# EAGLE design HMLPGVCA (EAGLE 9.6.2)
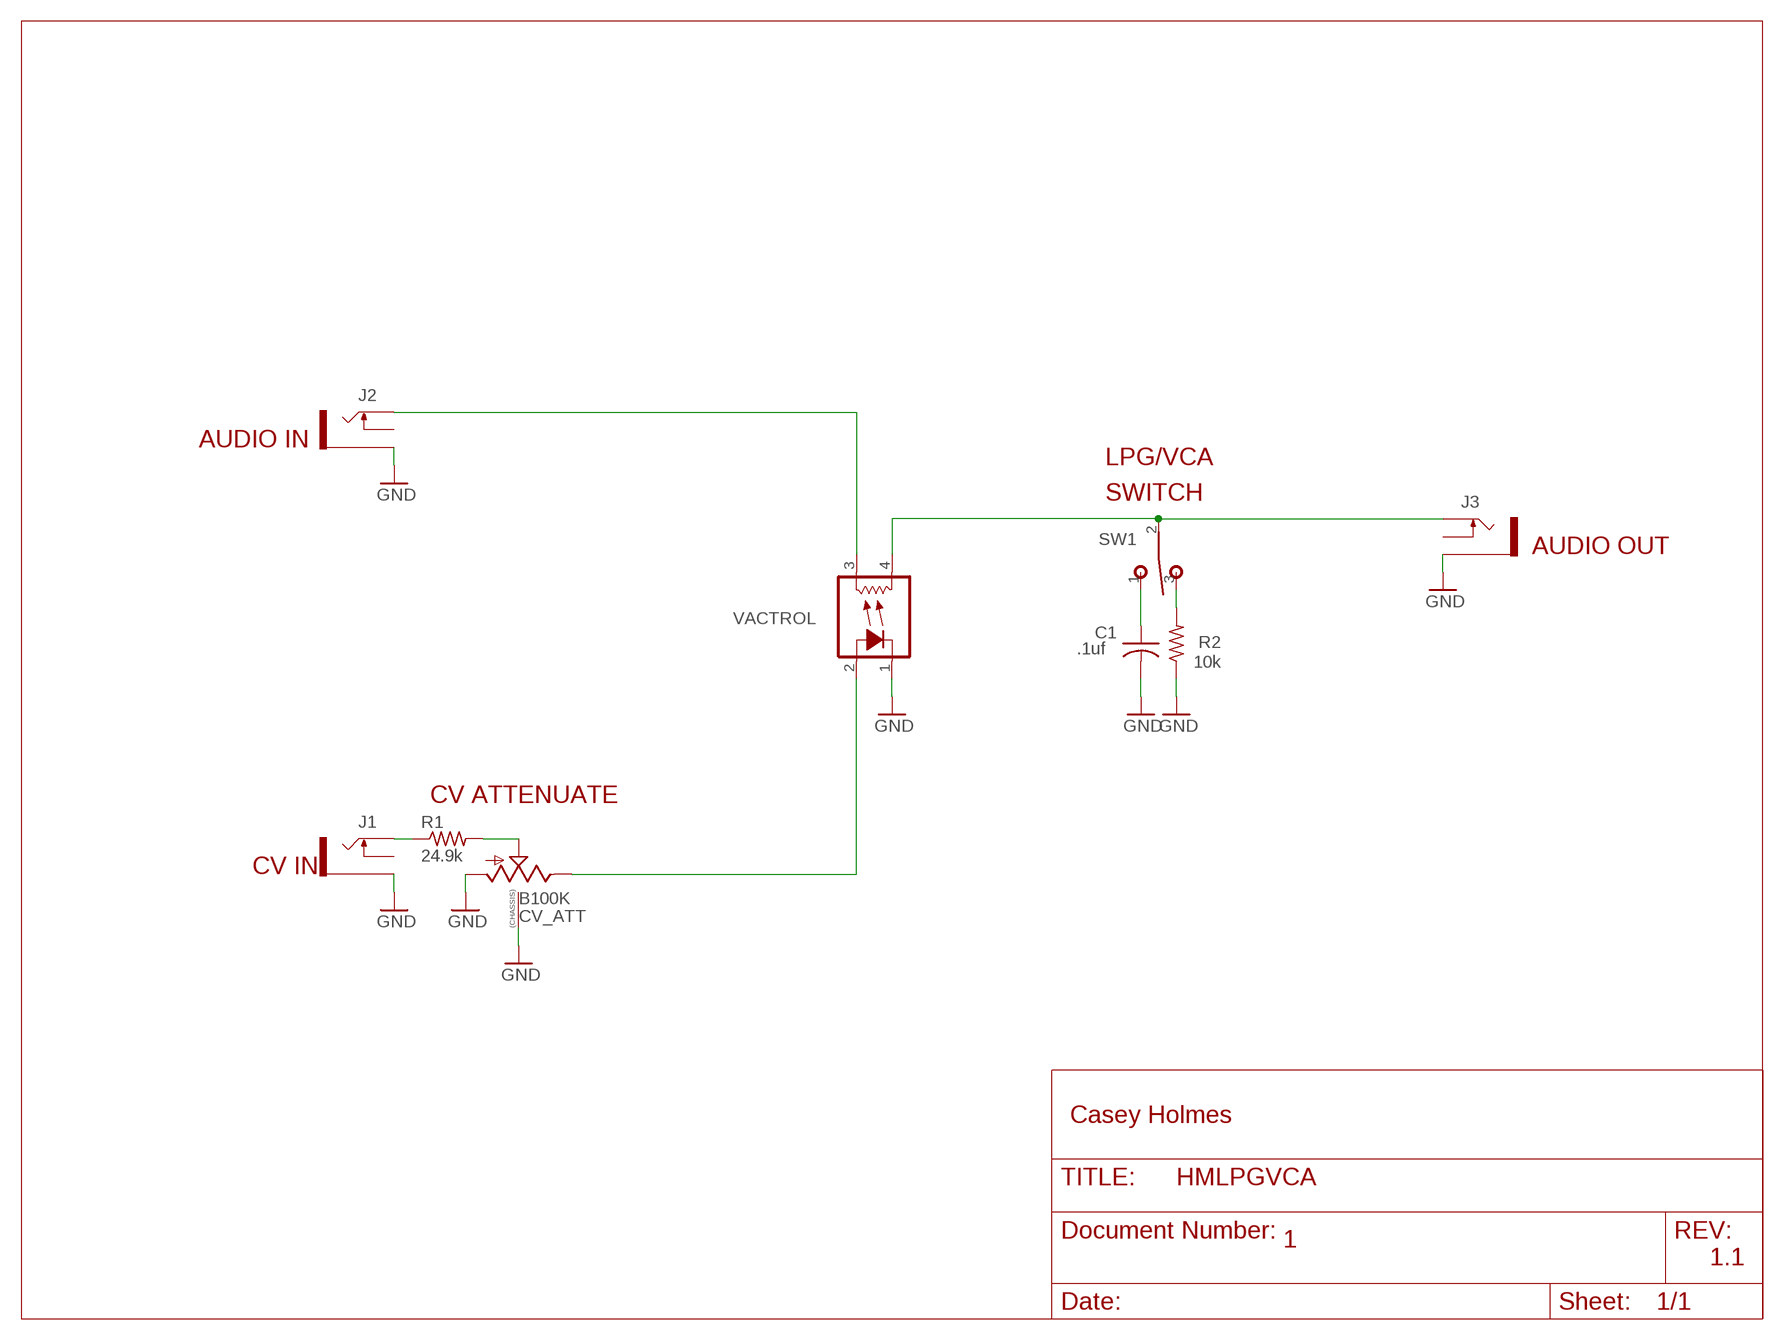
[diagram p0: schematic, sheet 1]

## Parts
C1  .1uf  C-USC0805K  [C0805K]
CV_ATT  B100K  9MM_SNAP-IN_POT_CHASSIS  [9MM_SNAP-IN_POT]
J1  THONKICONNNEW  [WQP-PJ301M-12_JACK]
J2  THONKICONNNEW  [WQP-PJ301M-12_JACK]
J3  THONKICONNNEW  [WQP-PJ301M-12_JACK]
R1  24.9k  R-US_R0805  [R0805]
R2  10k  R-US_R0805  [R0805]
SW1  T-80-T-SPDT-ON-OFF-ON  [M9040P]
VACTROL  VACTROL  VACTROL_4PIN  [VACTROL_4PIN_VTL5C]

## Nets
GND: C1.2 CV_ATT.1(A) CV_ATT.CHASSIS1 CV_ATT.CHASSIS2 J1.P$3_SLEEVE(SLEEVE) J2.P$3_SLEEVE(SLEEVE) J3.P$3_SLEEVE(SLEEVE) R2.1 VACTROL.1(LED-)
N$1: J1.P$1_TIP(TIP) R1.1
N$2: CV_ATT.2(S) R1.2
N$3: CV_ATT.3(E) VACTROL.2(LED+)
N$4: R2.2 SW1.3(S)
N$5: C1.1 SW1.1(O)
N$6: J3.P$1_TIP(TIP) SW1.2(P) VACTROL.4(RES2)
N$7: J2.P$1_TIP(TIP) VACTROL.3(RES1)
Unconnected: J1.P$2_SWITCH(SWITCH) J2.P$2_SWITCH(SWITCH) J3.P$2_SWITCH(SWITCH)

## Notes on the sheet
- AUDIO IN
- LPG/VCA
- SWITCH
- AUDIO OUT
- CV ATTENUATE
- CV IN
- Casey Holmes
- 1
- 1.1

## Library data of the parts
C1 = rcl:C-US: CAPACITOR, American symbol; SPICEPREFIX: C
CV_ATT = MusicThingModular:9MM_SNAP-IN_POT_CHASSIS: 9mm vertical snap-in pot, Alpha / Panasonic style, with a connection to the metal chassis for grounding
J1-J3 = MusicThingModular:THONKICONN: 3.5mm socket for Eurorack modular synths
R1 R2 = rcl:R-US_: RESISTOR, American symbol; SPICEPREFIX: R
SW1 = MusicThingModular:T-80-T-SPDT-ON-OFF-ON
VACTROL = MusicThingModular:VACTROL_4PIN: 4 Pin Vactrol Resistive Photocoupler

## Board
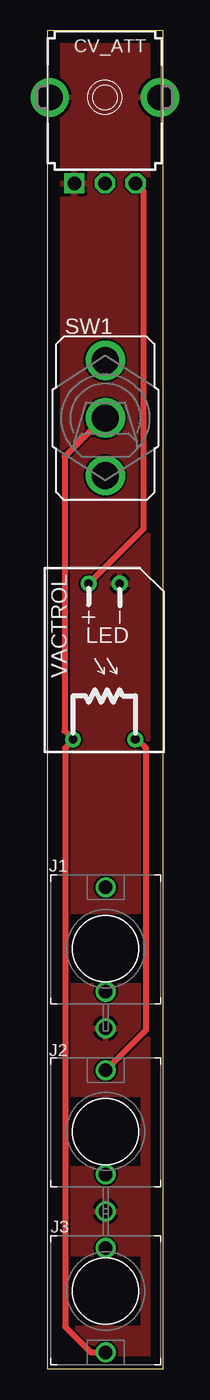
[diagram p1: board, top side]
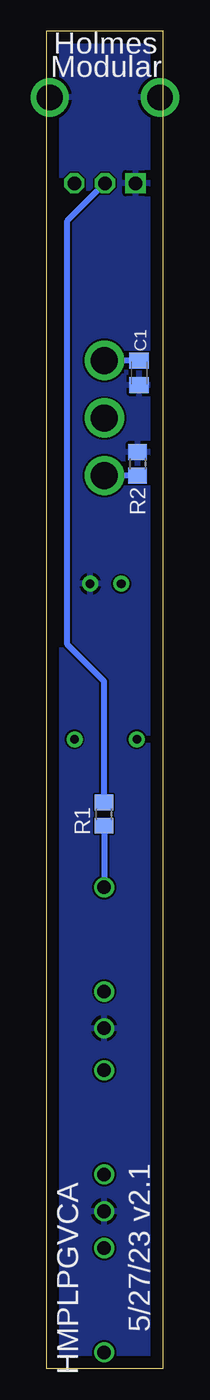
[diagram p2: board, bottom side, seen from below]

Size 9.45 x 109.21 mm. Coordinates in mm from the lower left corner, seen from the top.
Outline: 0,0 9.45,0 9.45,109.21 0,109.21 0,0
Copper layers (1*16): Top 0.035mm / dielectric 1.5mm / Bottom 0.035mm
Design rules "default": minimum track width 6mil, minimum drill 0.35mm, track to track 6mil, track to pad 6mil, pad to pad 6mil, via to via 6mil, smd to smd 6mil, copper to edge 40mil, drill to drill 6mil, minimum pad ring 10mil, minimum via ring 8mil, stop-mask expansion 4mil, vias tented up to drill 0mil, thermal gap 10mil

### Footprints (pad centres in the part's own frame; a part is rotated, then mirrored left to right if it is on the bottom)
C0805K = smd 1.3 x 1.6: 1 -1,0; 2 1,0
9MM_SNAP-IN_POT = drill 1.1 square: 1 -2.5,-7 | drill 1.1 octagon: 2 0,-7; 3 2.5,-7 | drill 2.1 pad 2.794: CHASSIS1 -4.5,0; CHASSIS2 4.5,0
WQP-PJ301M-12_JACK = drill 1.1: P$1_TIP 0,5; P$2_SWITCH 0,-3.5; P$3_SLEEVE 0,-6.5
R0805 = smd 1.3 x 1.5: 1 -0.95,0; 2 0.95,0
M9040P = drill 2.2: 1 0,4.699 | drill 2.2 pad 3: 2 0,0; 3 0,-4.699
VACTROL_4PIN_VTL5C = drill 0.7 pad 1.3: 1 -6.35,1.27; 2 -6.35,-1.27; 3 6.35,2.54; 4 6.35,-2.54

### Placement (x,y rotation side)
C1  1.91,81.28 270 bottom
CV_ATT  4.7,103.76 0 top
J1  4.76,34.29 0 top
J2  4.76,19.37 0 top
J3  4.76,6.35 180 top
R1  4.76,45.28 90 bottom
R2  2.03,73.85 270 bottom
SW1  4.74,77.6 0 top
VACTROL  4.64,57.72 270 top

### Tracks (layer width: path | path; a pad name or v marks a point on that pad's centre or on a via)
GND
  pour Bottom: 0,0 9.46,0 9.46,109.22 0,109.22
  pour Top: 0,0 9.46,0 9.46,109.22 0,109.22
N$1
  Bottom 0.508: R1.1 J1.P$1_TIP
N$2
  Bottom 0.508: R1.2 4.76,56.1 7.77,59.11 7.77,93.69 CV_ATT.2
N$3
  Top 0.508: CV_ATT.3 7.83,96.12 7.83,68.54 VACTROL.2
N$4
  Bottom 0.508: R2.2 SW1.3
N$5
  Bottom 0.508: C1.1 4.72,82.28 SW1.1
N$6
  Top 0.508: J3.P$1_TIP 3.55,1.35 1.45,3.44 1.45,50.66 2.1,51.3 VACTROL.4 1.42,52.05 1.42,74.46 4.55,77.6 SW1.2
N$7
  Top 0.508: VACTROL.3 7.36,51.37 8.07,50.66 8.07,27.68 J2.P$1_TIP

### Text on the board
bNames: Holmes | Modular | 5/27/23 v2.1 | HMPLPGVCA